# Altium schematic sheet LED_Chaser_Hardware.SchDoc
size B; Organization: Altium Limited; Address1: L3, 12a Rodborough Rd; Address2: Frenchs Forest; Address3: NSW; Address4: Australia 2086; DocumentNumber: 2; SheetNumber: 2; SheetTotal: 4
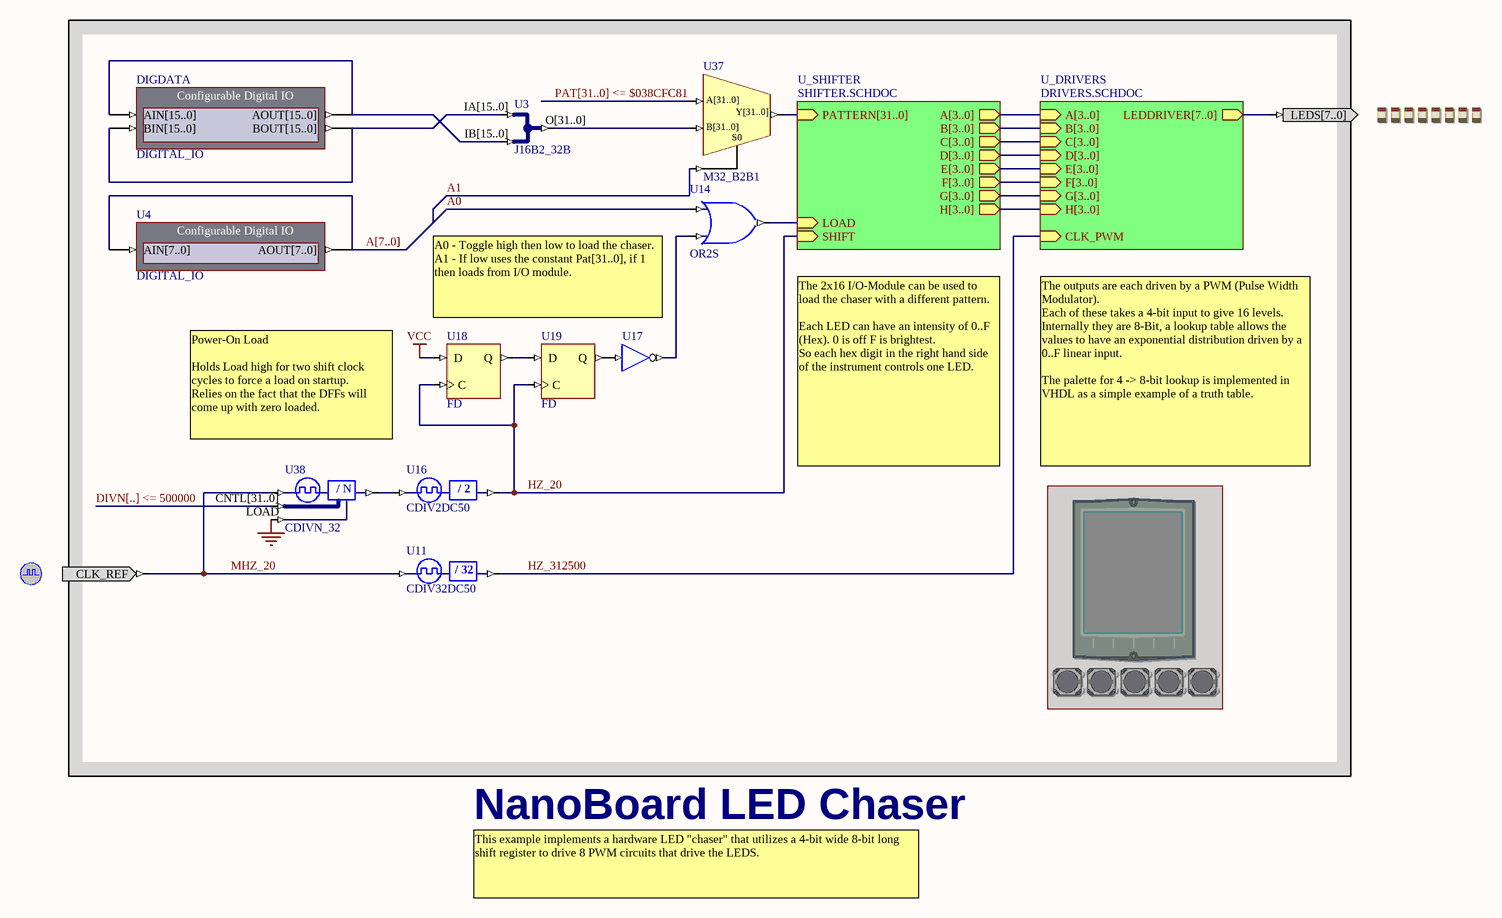
[diagram p0: LED_Chaser_Hardware.SchDoc]

## Parts
(Parts that share a designator on the sheet are numbered #1, #2 ... from top to bottom, then left to right.)
?#1  LED  (value not drawn)
?#2  FIRMWARE_TFT_ENABLE  (value not drawn)  (masked out: inside a compile mask, not in the netlist)
?#3  CLOCK_REFERENCE  (value not drawn)
?#4  FIRMWARE_BUTTONS_ENABLE  (value not drawn)  (masked out: inside a compile mask, not in the netlist)
DIGDATA  DIGITAL_IO
U3  J16B2_32B
U4  DIGITAL_IO
U11  CDIV32DC50
U14  OR2S
U16  CDIV2DC50
U17  INV  (value not drawn)
U18  FD
U19  FD
U37  M32_B2B1
U38  CDIVN_32

## Sub-sheets
U_DRIVERS = DRIVERS.SCHDOC: LEDDRIVER[7..0] (out), A[3..0] (in), B[3..0] (in), C[3..0] (in), D[3..0] (in), E[3..0] (in), F[3..0] (in), G[3..0] (in), H[3..0] (in), CLK_PWM (in)
U_SHIFTER = SHIFTER.SCHDOC: A[3..0] (out), B[3..0] (out), C[3..0] (out), D[3..0] (out), E[3..0] (out), F[3..0] (out), G[3..0] (out), H[3..0] (out), PATTERN[31..0] (in), SHIFT (in), LOAD (in)

## Nets
GND: U38.LOAD
VCC: U18.D
A0: U14.I0
A1: U37.S0
A[7..0]: U4.AIN[7..0] U4.AOUT[7..0]
DIVN[..] <= 500000: U38.CNTL[31..0]
HZ_20: U16.CLKDV U18.C U19.C ; sheet U_SHIFTER/SHIFT
HZ_312500: U11.CLKDV ; sheet U_DRIVERS/CLK_PWM
MHZ_20: ?#3.CLK_REF U11.CLKIN U38.CLKIN
PAT[31..0] <= $038CFC81: U37.A[31..0]
Net?#1_LEDS[7..0]: ?#1.LEDS[7..0] ; sheet U_DRIVERS/LEDDRIVER[7..0]
NetDIGDATA_AIN[15..0]: DIGDATA.AIN[15..0] DIGDATA.AOUT[15..0] U3.IB[15..0]
NetDIGDATA_BIN[15..0]: DIGDATA.BIN[15..0] DIGDATA.BOUT[15..0] U3.IA[15..0]
NetU3_O[31..0]: U3.O[31..0] U37.B[31..0]
NetU14_I1: U14.I1 U17.O
NetU14_O: U14.O ; sheet U_SHIFTER/LOAD
NetU16_CLKIN: U16.CLKIN U38.CLKDV
NetU17_I: U17.I U19.Q
NetU18_Q: U18.Q U19.D
NetU37_Y[31..0]: U37.Y[31..0] ; sheet U_SHIFTER/PATTERN[31..0]

## Buses and harness runs
bus A[7..0]
bus DIVN[..] <= 500000
bus PAT[31..0] <= $038CFC81
bus sheet U_DRIVERS/A[3..0] = sheet U_SHIFTER/A[3..0]
bus sheet U_DRIVERS/B[3..0] = sheet U_SHIFTER/B[3..0]
bus sheet U_DRIVERS/C[3..0] = sheet U_SHIFTER/C[3..0]
bus sheet U_DRIVERS/D[3..0] = sheet U_SHIFTER/D[3..0]
bus sheet U_DRIVERS/E[3..0] = sheet U_SHIFTER/E[3..0]
bus sheet U_DRIVERS/F[3..0] = sheet U_SHIFTER/F[3..0]
bus sheet U_DRIVERS/G[3..0] = sheet U_SHIFTER/G[3..0]
bus sheet U_DRIVERS/H[3..0] = sheet U_SHIFTER/H[3..0]

## Notes on the sheet
- A0 - Toggle high then low to load the chaser.
  A1 - If low uses the constant Pat[31..0], if 1 then loads from I/O module.
- Power-On Load
  Holds Load high for two shift clock cycles to force a load on startup.
  Relies on the fact that the DFFs will come up with zero loaded.
- The 2x16 I/O-Module can be used to load the chaser with a different pattern.
  Each LED can have an intensity of 0..F (Hex). 0 is off F is brightest.
  So each hex digit in the right hand side of the instrument controls one LED.
- The outputs are each driven by a PWM (Pulse Width Modulator).
  Each of these takes a 4-bit input to give 16 levels.
  Internally they are 8-Bit, a lookup table allows the values to have an exponential distribution driven by a 0..F linear input.
  The palette for 4 -> 8-bit lookup is implemented in VHDL as a simple example of a truth table.
- NanoBoard LED Chaser
- This example implements a hardware LED "chaser" that utilizes a 4-bit wide 8-bit long shift register to drive 8 PWM circuits that drive the LEDS.
- Title
- Size:
- Date:
- B
- Number:
- Time:
- Revision:
- Sheet
- of
- File:
- (in symbol CDIV2DC50) / 2
- (in symbol CDIV32DC50) / 32
- (in symbol CDIVN_32) / N

## Library data of the parts
?#1 = LED: Bank of eight Red LEDs; PortComponent: True; Published: 19-Nov-2003; Publisher: Altium Limited; HelpURL: TR0143 Technical Reference Manual for Altium's Desktop NanoBoard NB2DSK01.pdf#page=51
?#2 = FIRMWARE_TFT_ENABLE: TFT LCD Panel; PortComponent: True; Published: 22-Jan-2007; Publisher: Altium Limited; HelpURL: TR0143 Technical Reference Manual for Altium's Desktop NanoBoard NB2DSK01.pdf#page=50
?#3 = CLOCK_REFERENCE: Global System Clock Reference Supply; PortComponent: True; Published: 19-Nov-2003; Publisher: Altium Limited; HelpURL: TR0143 Technical Reference Manual for Altium's Desktop NanoBoard NB2DSK01.pdf#page=41
?#4 = FIRMWARE_BUTTONS_ENABLE: Generic User Buttons; PortComponent: True; Published: 16-Apr-2007; Publisher: Altium Limited; HelpURL: TR0143 Technical Reference Manual for Altium's Desktop NanoBoard NB2DSK01.pdf#page=53
DIGDATA = DIGITAL_IO: Configurable Digital IO; NEXUS_CORE: Instrument; NEXUS_JTAG_DEVICE: True; NEXUS_JTAG_ORDER: 0; ConfigurationParameters: {}Version[1.0]{}Input0Name[AIN{1}15..0{2}]{}Input0Width[16]{}Input0InitValue[0]{}Input0Kind[LEDs]{}Input0LEDStyle[Red]{}Input1Name[BIN{1}15..0{2}]{}Input1Width[16]{}Input1InitValue[0]{}Input1Kind[LEDs]{}Input1LEDStyle[Red]{}Output0Name[AOUT{1}15..0{2}]{}Output0Width[16]{}Output0InitValue[0]{}Output0Kind[Numeric]{}Output0NumRadix[Binary]{}Output1Name[BOUT{1}15..0{2}]{}Output1Width[16]{}Output1InitValue[0]{}Output1Kind[Numeric]{}Output1NumRadix[Binary]{}; ConfiguratorName: DIGITAL_IO; ComponentLink1Description: Core &Resource Usage; ComponentLink1URL: CR0134 FPGA Instrument Resource Usage.pdf; Core Revision: 1.00.00; HelpURL: CR0179 DIGITAL_IO Configurable Digital IO Module.pdf; LastRevisionNo: 1.00.00; Published: 28-Jun-2007; Publisher: Altium Limited; UseInDSF: True
U3 = J16B2_32B: 2 x 16-Bit input bus to 1 x 32-bit output bus; ArchiveName: GENERIC; Published: 18-Dec-2003; Publisher: Altium Limited; Core Revision: 1.00.00
U4 = DIGITAL_IO: Configurable Digital IO; NEXUS_CORE: Instrument; NEXUS_JTAG_DEVICE: True; NEXUS_JTAG_ORDER: 0; ConfigurationParameters: {}Version[1.0]{}Input0Name[AIN{1}7..0{2}]{}Input0Width[8]{}Input0InitValue[0]{}Input0Kind[LEDs]{}Input0LEDStyle[Red]{}Output0Name[AOUT{1}7..0{2}]{}Output0Width[8]{}Output0InitValue[0]{}Output0Kind[Numeric]{}Output0NumRadix[Binary]{}; ConfiguratorName: DIGITAL_IO; ComponentLink1Description: Core &Resource Usage; ComponentLink1URL: CR0134 FPGA Instrument Resource Usage.pdf; Core Revision: 1.00.00; HelpURL: CR0179 DIGITAL_IO Configurable Digital IO Module.pdf; LastRevisionNo: 1.00.00; Published: 28-Jun-2007; Publisher: Altium Limited; UseInDSF: True
U11 = CDIV32DC50: Clock Divider by 32 with 50% Duty Cycle Output; ArchiveName: GENERIC; Published: 18-Dec-2003; Publisher: Altium Limited; Core Revision: 1.00.00
U14 = OR2S: 2-Input OR Gate, Single Pin Version; Xilinx Equivalent: OR2; ArchiveName: GENERIC; Published: 18-Dec-2003; Publisher: Altium Limited; Core Revision: 1.00.00
U16 = CDIV2DC50: Clock Divider by 2 with 50% Duty Cycle Output; Xilinx Equivalent: CLK_DIV2; ArchiveName: GENERIC; Published: 18-Dec-2003; Publisher: Altium Limited; Core Revision: 1.00.00
U17 = INV: Inverter; ArchiveName: GENERIC; Published: 18-Nov-2003; Publisher: Altium Limited; Xilinx Equivalent: INV; Core Revision: 1.00.00
U18 U19 = FD: D-Type Flip-Flop; ArchiveName: GENERIC; Published: 18-Dec-2003; Publisher: Altium Limited; Xilinx Equivalent: FD; Core Revision: 1.00.00
U37 = M32_B2B1: 2x32-Bit Bus to 1x32-Bit Bus Multiplexer; ArchiveName: GENERIC; Published: 18-Dec-2003; Publisher: Altium Limited; Core Revision: 1.00.00
U38 = CDIVN_32: 32-Bit Programmable Clock Divider; ArchiveName: GENERIC; Published: 18-Dec-2003; Publisher: Altium Limited; Core Revision: 1.00.00